# EAGLE schematic keyBoard_B (EAGLE 6.4)
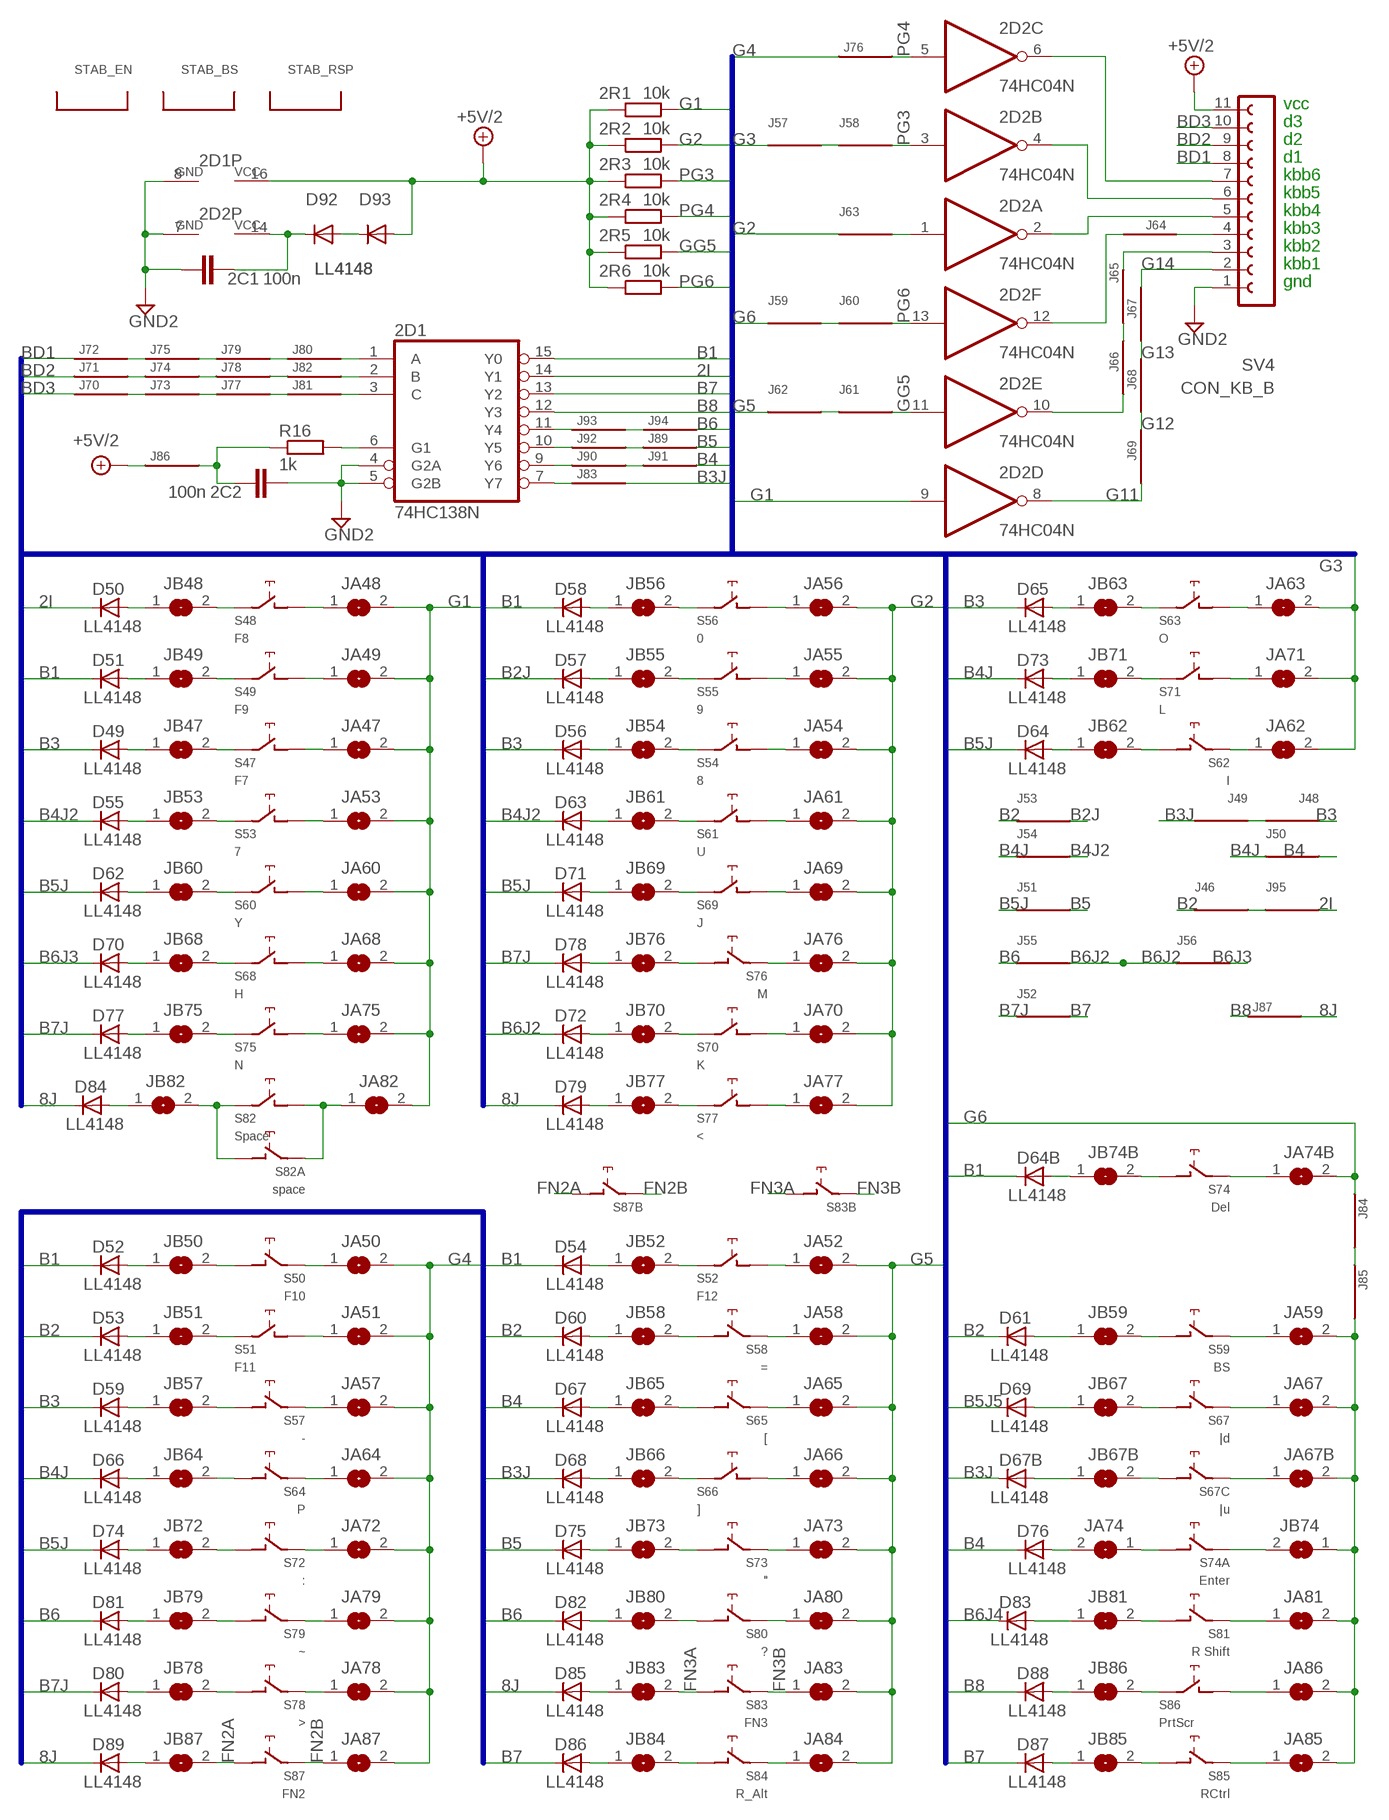
[diagram p0: schematic, sheet 1]

## Parts
2C1  100n  C-EUC1206  [C1206]
2C2  100n  C-EUC1206K  [C1206K]
2D1  74HC138N  74AC138N  [DIL16]
2D2  74HC04N  74ALS04N  [DIL14]
2R1  10k  R-EU_R0805  [R0805]
2R2  10k  R-EU_R0805  [R0805]
2R3  10k  R-EU_R0805  [R0805]
2R4  10k  R-EU_R1206W  [R1206W]
2R5  10k  R-EU_R0805  [R0805]
2R6  10k  R-EU_R0805  [R0805]
D49  LL4148  [SOD80C]
D50  LL4148  [SOD80C]
D51  LL4148  [SOD80C]
D52  LL4148  [SOD80C]
D53  LL4148  [SOD80C]
D54  LL4148  [SOD80C]
D55  LL4148  [SOD80C]
D56  LL4148  [SOD80C]
D57  LL4148  [SOD80C]
D58  LL4148  [SOD80C]
D59  LL4148  [SOD80C]
D60  LL4148  [SOD80C]
D61  LL4148  [SOD80C]
D62  LL4148  [SOD80C]
D63  LL4148  [SOD80C]
D64  LL4148  [SOD80C]
D64B  LL4148  [SOD80C]
D65  LL4148  [SOD80C]
D66  LL4148  [SOD80C]
D67  LL4148  [SOD80C]
D67B  LL4148  [SOD80C]
D68  LL4148  [SOD80C]
D69  LL4148  [SOD80C]
D70  LL4148  [SOD80C]
D71  LL4148  [SOD80C]
D72  LL4148  [SOD80C]
D73  LL4148  [SOD80C]
D74  LL4148  [SOD80C]
D75  LL4148  [SOD80C]
D76  LL4148  [SOD80C]
D77  LL4148  [SOD80C]
D78  LL4148  [SOD80C]
D79  LL4148  [SOD80C]
D80  LL4148  [SOD80C]
D81  LL4148  [SOD80C]
D82  LL4148  [SOD80C]
D83  LL4148  [SOD80C]
D84  LL4148  [SOD80C]
D85  LL4148  [SOD80C]
D86  LL4148  [SOD80C]
D87  LL4148  [SOD80C]
D88  LL4148  [SOD80C]
D89  LL4148  [SOD80C]
D92  LL4148  [SOD80C]
D93  LL4148  [SOD80C]
J46  J  [R1206W]
J48  J  [R1206W]
J49  J  [R1206W]
J50  J  [R1206W]
J51  J  [R1206W]
J52  J  [R1206W]
J53  J  [R1206W]
J54  J  [R1206W]
J55  J  [R1206W]
J56  J  [R1206W]
J57  J  [R1206W]
J58  J  [R1206W]
J59  J  [R1206W]
J60  J  [R1206W]
J61  J  [R1206W]
J62  J  [R1206W]
J63  J  [R1206W]
J64  J  [R1206W]
J65  J  [R1206W]
J66  J  [R1206W]
J67  J  [R1206W]
J68  J  [R1206W]
J69  J  [R1206W]
J70  J  [R1206W]
J71  J  [R1206W]
J72  J  [R1206W]
J73  J  [R1206W]
J74  J  [R1206W]
J75  J  [R1206W]
J76  J  [R1206W]
J77  J  [R1206W]
J78  J  [R1206W]
J79  J  [R1206W]
J80  J  [R1206W]
J81  J  [R1206W]
J82  J  [R1206W]
J83  J  [R1206W]
J84  J  [R1206W]
J85  J  [R1206W]
J86  J  [R1206W]
J87  J  [R1206W]
J89  J  [R1206W]
J90  J  [R1206W]
J91  J  [R1206W]
J92  J  [R1206W]
J93  J  [R1206W]
J94  J  [R1206W]
J95  J  [R1206W]
JA47  SJ  [SJ]
JA48  SJ  [SJ]
JA49  SJ  [SJ]
JA50  SJ  [SJ]
JA51  SJ  [SJ]
JA52  SJ  [SJ]
JA53  SJ  [SJ]
JA54  SJ  [SJ]
JA55  SJ  [SJ]
JA56  SJ  [SJ]
JA57  SJ  [SJ]
JA58  SJ  [SJ]
JA59  SJ  [SJ]
JA60  SJ  [SJ]
JA61  SJ  [SJ]
JA62  SJ  [SJ]
JA63  SJ  [SJ]
JA64  SJ  [SJ]
JA65  SJ  [SJ]
JA66  SJ  [SJ]
JA67  SJ  [SJ]
JA67B  SJ  [SJ]
JA68  SJ  [SJ]
JA69  SJ  [SJ]
JA70  SJ  [SJ]
JA71  SJ  [SJ]
JA72  SJ  [SJ]
JA73  SJ  [SJ]
JA74  SJ  [SJ]
JA74B  SJ  [SJ]
JA75  SJ  [SJ]
JA76  SJ  [SJ]
JA77  SJ  [SJ]
JA78  SJ  [SJ]
JA79  SJ  [SJ]
JA80  SJ  [SJ]
JA81  SJ  [SJ]
JA82  SJ  [SJ]
JA83  SJ  [SJ]
JA84  SJ  [SJ]
JA85  SJ  [SJ]
JA86  SJ  [SJ]
JA87  SJ  [SJ]
JB47  SJ  [SJ]
JB48  SJ  [SJ]
JB49  SJ  [SJ]
JB50  SJ  [SJ]
JB51  SJ  [SJ]
JB52  SJ  [SJ]
JB53  SJ  [SJ]
JB54  SJ  [SJ]
JB55  SJ  [SJ]
JB56  SJ  [SJ]
JB57  SJ  [SJ]
JB58  SJ  [SJ]
JB59  SJ  [SJ]
JB60  SJ  [SJ]
JB61  SJ  [SJ]
JB62  SJ  [SJ]
JB63  SJ  [SJ]
JB64  SJ  [SJ]
JB65  SJ  [SJ]
JB66  SJ  [SJ]
JB67  SJ  [SJ]
JB67B  SJ  [SJ]
JB68  SJ  [SJ]
JB69  SJ  [SJ]
JB70  SJ  [SJ]
JB71  SJ  [SJ]
JB72  SJ  [SJ]
JB73  SJ  [SJ]
JB74  SJ  [SJ]
JB74B  SJ  [SJ]
JB75  SJ  [SJ]
JB76  SJ  [SJ]
JB77  SJ  [SJ]
JB78  SJ  [SJ]
JB79  SJ  [SJ]
JB80  SJ  [SJ]
JB81  SJ  [SJ]
JB82  SJ  [SJ]
JB83  SJ  [SJ]
JB84  SJ  [SJ]
JB85  SJ  [SJ]
JB86  SJ  [SJ]
JB87  SJ  [SJ]
R16  1k  R-EU_R1206W  [R1206W]
S47  F7  CHERRY-MX-4P  [CHERRY-MX-4P]
S48  F8  CHERRY-MX-4P  [CHERRY-MX-4P]
S49  F9  CHERRY-MX-4P  [CHERRY-MX-4P]
S50  F10  CHERRY-MX-4P  [CHERRY-MX-4P]
S51  F11  CHERRY-MX-4P  [CHERRY-MX-4P]
S52  F12  CHERRY-MX-4P  [CHERRY-MX-4P]
S53  7  CHERRY-MX-4P  [CHERRY-MX-4P]
S54  8  CHERRY-MX-4P  [CHERRY-MX-4P]
S55  9  CHERRY-MX-4P  [CHERRY-MX-4P]
S56  0  CHERRY-MX-4P  [CHERRY-MX-4P]
S57  -  CHERRY-MX-4P  [CHERRY-MX-4P]
S58  =  CHERRY-MX-4P  [CHERRY-MX-4P]
S59  BS  CHERRY-MX-4P  [CHERRY-MX-4P]
S60  Y  CHERRY-MX-4P  [CHERRY-MX-4P]
S61  U  CHERRY-MX-4P  [CHERRY-MX-4P]
S62  I  CHERRY-MX-4P  [CHERRY-MX-4P]
S63  O  CHERRY-MX-4P  [CHERRY-MX-4P]
S64  P  CHERRY-MX-4P  [CHERRY-MX-4P]
S65  [  CHERRY-MX-4P  [CHERRY-MX-4P]
S66  ]  CHERRY-MX-4P  [CHERRY-MX-4P]
S67  |d  CHERRY-MX-4P  [CHERRY-MX-4P]
S67C  |u  CHERRY-MX-4P  [CHERRY-MX-4P]
S68  H  CHERRY-MX-4P  [CHERRY-MX-4P]
S69  J  CHERRY-MX-4P  [CHERRY-MX-4P]
S70  K  CHERRY-MX-4P  [CHERRY-MX-4P]
S71  L  CHERRY-MX-4P  [CHERRY-MX-4P]
S72  :  CHERRY-MX-4P  [CHERRY-MX-4P]
S73  "  CHERRY-MX-4P  [CHERRY-MX-4P]
S74  Del  CHERRY-MX-4P  [CHERRY-MX-4P]
S74A  Enter  CHERRY-MX-4P  [CHERRY-MX-4P]
S75  N  CHERRY-MX-4P  [CHERRY-MX-4P]
S76  M  CHERRY-MX-4P  [CHERRY-MX-4P]
S77  <  CHERRY-MX-4P  [CHERRY-MX-4P]
S78  >  CHERRY-MX-4P  [CHERRY-MX-4P]
S79  ~  CHERRY-MX-4P  [CHERRY-MX-4P]
S80  ?  CHERRY-MX-4P  [CHERRY-MX-4P]
S81  R Shift  CHERRY-MX-4P  [CHERRY-MX-4P]
S82  Space  CHERRY-MX-4P  [CHERRY-MX-4P]
S82A  space  CHERRY-MX  [CHERRY-MX]
S83  FN3  CHERRY-MX-4P  [CHERRY-MX-4P]
S83B  CHERRY-MX  [CHERRY-MX]
S84  R_Alt  CHERRY-MX-4P  [CHERRY-MX-4P]
S85  RCtrl  CHERRY-MX-4P  [CHERRY-MX-4P]
S86  PrtScr  CHERRY-MX-4P  [CHERRY-MX-4P]
S87  FN2  CHERRY-MX-4P  [CHERRY-MX-4P]
S87B  CHERRY-MX  [CHERRY-MX]
STAB_BS  STAB  [ZEALIOS-PCB_2U]
STAB_EN  STAB  [ZEALIOS-PCB_2U]
STAB_RSP  STAB  [ZEALIOS-PCB_2U]
SV4  CON_KB_B  FE12-1  [FE12]

## Nets
2I: 2D1.14(Y1) D50.C J95.1
8J: D79.C D84.C D85.C D89.C J87.1
+3VD: 2C1.1 2D2.14(P:VCC) D92.C
+5V/2: 2D1.16(VCC) 2R1.1 2R2.1 2R3.1 2R4.1 2R5.1 2R6.1 D93.A J86.2 SV4.11
B1: 2D1.15(Y0) D51.C D52.C D54.C D58.C D64B.C
B2: D53.C D60.C D61.C J46.2 J53.2
B2J: D57.C J53.1
B3: D49.C D56.C D59.C D65.C J48.2
B3J: D67B.C D68.C J49.1 J83.1
B4: D67.C D76.C J50.1 J91.1
B4J: D66.C D73.C J50.2 J54.2
B4J2: D55.C D63.C J54.1
B5: D75.C J51.1 J89.1
B5J: D62.C D64.C D71.C D74.C J51.2
B5J4: J89.2 J92.1
B5J5: 2D1.10(Y5) D69.C J92.2
B6: D81.C D82.C J55.2 J94.1
B6J2: D72.C J55.1 J56.2
B6J3: D70.C J56.1
B6J4: D83.C J93.1 J94.2
B7: 2D1.13(Y2) D86.C D87.C J52.1
B7J: D77.C D78.C D80.C J52.2
B8: 2D1.12(Y3) D88.C J87.2
BD1: J72.2 SV4.8
BD2: J71.2 SV4.9
BD3: J70.2 SV4.10
FN2A: JB87.2 S87.SW2(PIN-2) S87B.SW2(PIN-2)
FN2B: JA87.1 S87.SW1(PIN-1) S87B.SW1(PIN-1)
FN3A: JB83.2 S83.SW2(PIN-2) S83B.SW2(PIN-2)
FN3B: JA83.1 S83.SW1(PIN-1) S83B.SW1(PIN-1)
G1: 2D2.9(D:I) 2R1.2 JA47.2 JA48.2 JA49.2 JA53.2 JA60.2 JA68.2 JA75.2 JA82.2
G2: 2R2.2 J63.2 JA54.2 JA55.2 JA56.2 JA61.2 JA69.2 JA70.2 JA76.2 JA77.2
G3: J57.2 JA62.2 JA63.2 JA71.2
G4: J76.2 JA50.2 JA51.2 JA57.2 JA64.2 JA72.2 JA78.2 JA79.2 JA87.2
G5: J62.2 JA52.2 JA58.2 JA65.2 JA66.2 JA73.2 JA80.2 JA83.2 JA84.2
G6: J59.2 J84.2 JA74B.2
G6B: J84.1 J85.2
G6C: J85.1 JA59.2 JA67.2 JA67B.2 JA81.2 JA85.2 JA86.2 JB74.1
G11: 2D2.8(D:O) J69.2
G12: J68.2 J69.1
G13: J67.2 J68.1
G14: J67.1 SV4.2
GG5: 2D2.11(E:I) 2R5.2 J61.1
GND2: 2C1.2 2C2.2 2D1.4(G2A) 2D1.5(G2B) 2D1.8(GND) 2D2.7(P:GND) SV4.1
N$107: JB52.2 S52.SW1(PIN-1)
N$117: 2D1.7(Y7) J83.2
N$151: JB63.2 S63.SW1(PIN-1)
N$225: 2C2.1 J86.1 R16.1
N$229: JB74.2 S74A.SW1(PIN-1)
N$230: JA74.1 S74A.SW2(PIN-2)
N$233: JB47.2 S47.SW1(PIN-1)
N$234: JB53.2 S53.SW1(PIN-1)
N$235: JB60.2 S60.SW1(PIN-1)
N$236: JB68.2 S68.SW1(PIN-1)
N$237: JB75.2 S75.SW1(PIN-1)
N$238: JB82.2 S82.SW1(PIN-1) S82A.SW2(PIN-2)
N$239: JB48.2 S48.SW1(PIN-1)
N$240: JB54.2 S54.SW1(PIN-1)
N$241: JB61.2 S61.SW1(PIN-1)
N$242: JB69.2 S69.SW1(PIN-1)
N$243: JB49.2 S49.SW1(PIN-1)
N$244: JB55.2 S55.SW1(PIN-1)
N$245: JB70.2 S70.SW1(PIN-1)
N$246: JB77.2 S77.SW1(PIN-1)
N$247: JB56.2 S56.SW1(PIN-1)
N$248: JB51.2 S51.SW1(PIN-1)
N$249: D49.A JB47.1
N$250: D55.A JB53.1
N$251: D62.A JB60.1
N$252: D70.A JB68.1
N$253: D77.A JB75.1
N$254: D84.A JB82.1
N$255: D50.A JB48.1
N$256: D56.A JB54.1
N$257: D63.A JB61.1
N$258: D71.A JB69.1
N$259: D78.A JB76.1
N$260: D85.A JB83.1
N$261: D51.A JB49.1
N$262: D57.A JB55.1
N$263: D64.A JB62.1
N$264: D72.A JB70.1
N$265: D79.A JB77.1
N$266: D86.A JB84.1
N$267: D52.A JB50.1
N$268: D58.A JB56.1
N$269: D65.A JB63.1
N$270: D73.A JB71.1
N$271: D80.A JB78.1
N$272: D87.A JB85.1
N$274: D53.A JB51.1
N$275: D59.A JB57.1
N$277: D66.A JB64.1
N$278: D74.A JB72.1
N$279: D81.A JB79.1
N$280: D88.A JB86.1
N$281: D54.A JB52.1
N$282: D60.A JB58.1
N$283: D67.A JB65.1
N$285: D75.A JB73.1
N$286: D82.A JB80.1
N$287: D61.A JB59.1
N$288: D68.A JB66.1
N$289: D69.A JB67.1
N$290: D83.A JB81.1
N$291: JA47.1 S47.SW2(PIN-2)
N$292: JA53.1 S53.SW2(PIN-2)
N$293: JA60.1 S60.SW2(PIN-2)
N$294: JA68.1 S68.SW2(PIN-2)
N$295: JA75.1 S75.SW2(PIN-2)
N$296: JA82.1 S82.SW2(PIN-2) S82A.SW1(PIN-1)
N$297: JA48.1 S48.SW2(PIN-2)
N$298: JA54.1 S54.SW2(PIN-2)
N$299: JA61.1 S61.SW2(PIN-2)
N$300: JA69.1 S69.SW2(PIN-2)
N$301: JA49.1 S49.SW2(PIN-2)
N$302: JA55.1 S55.SW2(PIN-2)
N$303: JA70.1 S70.SW2(PIN-2)
N$304: JA77.1 S77.SW2(PIN-2)
N$305: JA56.1 S56.SW2(PIN-2)
N$306: JA63.1 S63.SW2(PIN-2)
N$307: JA51.1 S51.SW2(PIN-2)
N$308: JA52.1 S52.SW2(PIN-2)
N$309: D64B.A JB74B.1
N$310: 2D1.11(Y4) J93.2
N$311: JA67B.1 S67C.SW1(PIN-1)
N$312: D76.A JA74.2
N$313: JB67.2 S67.SW2(PIN-2)
N$314: JA67.1 S67.SW1(PIN-1)
N$315: JB81.2 S81.SW2(PIN-2)
N$316: JA81.1 S81.SW1(PIN-1)
N$317: JB59.2 S59.SW2(PIN-2)
N$318: JA59.1 S59.SW1(PIN-1)
N$319: JB85.2 S85.SW2(PIN-2)
N$320: JA85.1 S85.SW1(PIN-1)
N$321: JB74B.2 S74.SW2(PIN-2)
N$322: JA74B.1 S74.SW1(PIN-1)
N$323: 2D1.9(Y6) J90.2
N$326: D89.A JB87.1
N$327: JB50.2 S50.SW2(PIN-2)
N$328: JA50.1 S50.SW1(PIN-1)
N$329: JB78.2 S78.SW2(PIN-2)
N$330: JA78.1 S78.SW1(PIN-1)
N$331: D67B.A JB67B.1
N$332: JB58.2 S58.SW2(PIN-2)
N$333: JB65.2 S65.SW2(PIN-2)
N$334: JA65.1 S65.SW1(PIN-1)
N$335: JA58.1 S58.SW1(PIN-1)
N$336: JB66.2 S66.SW1(PIN-1)
N$337: JA66.1 S66.SW2(PIN-2)
N$338: JB79.2 S79.SW2(PIN-2)
N$339: JA79.1 S79.SW1(PIN-1)
N$342: JB73.2 S73.SW2(PIN-2)
N$343: JA73.1 S73.SW1(PIN-1)
N$344: JA80.1 S80.SW1(PIN-1)
N$345: JB80.2 S80.SW2(PIN-2)
N$346: JB84.2 S84.SW2(PIN-2)
N$347: JA84.1 S84.SW1(PIN-1)
N$349: JB57.2 S57.SW2(PIN-2)
N$350: JA57.1 S57.SW1(PIN-1)
N$351: JA64.1 S64.SW1(PIN-1)
N$352: JB64.2 S64.SW2(PIN-2)
N$353: JB72.2 S72.SW2(PIN-2)
N$354: JA72.1 S72.SW1(PIN-1)
N$355: J48.1 J49.2
N$356: JB62.2 S62.SW2(PIN-2)
N$357: JA62.1 S62.SW1(PIN-1)
N$358: JB71.2 S71.SW1(PIN-1)
N$359: JA71.1 S71.SW2(PIN-2)
N$360: 2D1.6(G1) R16.2
N$361: JB76.2 S76.SW2(PIN-2)
N$362: JA76.1 S76.SW1(PIN-1)
N$363: 2D2.6(C:O) SV4.7
N$364: 2D2.4(B:O) SV4.6
N$365: 2D2.2(A:O) SV4.5
N$366: 2D2.12(F:O) J64.2
N$368: J57.1 J58.2
N$369: J59.1 J60.2
N$370: 2D2.1(A:I) J63.1
N$371: J64.1 SV4.4
N$372: J65.1 SV4.3
N$373: J65.2 J66.1
N$374: 2D2.10(E:O) J66.2
N$378: D92.A D93.C
N$379: J70.1 J73.2
N$380: J71.1 J74.2
N$381: J72.1 J75.2
N$382: J73.1 J77.2
N$383: J74.1 J78.2
N$384: J75.1 J79.2
N$385: J79.1 J80.2
N$386: J77.1 J81.2
N$387: J78.1 J82.2
N$388: 2D1.1(A) J80.1
N$389: 2D1.2(B) J82.1
N$391: 2D1.3(C) J81.1
N$396: JB86.2 S86.SW1(PIN-1)
N$397: JA86.1 S86.SW2(PIN-2)
N$399: J90.1 J91.2
N$405: J46.1 J95.2
N$406: JB67B.2 S67C.SW2(PIN-2)
PG3: 2D2.3(B:I) 2R3.2 J58.1
PG4: 2D2.5(C:I) 2R4.2 J76.1
PG5: J61.2 J62.1
PG6: 2D2.13(F:I) 2R6.2 J60.1
Unconnected: S47.D1(_D:D1) S47.D2(_D:D2) S47.LED1(_L:LED1) S47.LED2(_L:LED2) S48.D1(_D:D1) S48.D2(_D:D2) S48.LED1(_L:LED1) S48.LED2(_L:LED2) S49.D1(_D:D1) S49.D2(_D:D2) S49.LED1(_L:LED1) S49.LED2(_L:LED2) S50.D1(_D:D1) S50.D2(_D:D2) S50.LED1(_L:LED1) S50.LED2(_L:LED2) S51.D1(_D:D1) S51.D2(_D:D2) S51.LED1(_L:LED1) S51.LED2(_L:LED2) S52.D1(_D:D1) S52.D2(_D:D2) S52.LED1(_L:LED1) S52.LED2(_L:LED2) S53.D1(_D:D1) S53.D2(_D:D2) S53.LED1(_L:LED1) S53.LED2(_L:LED2) S54.D1(_D:D1) S54.D2(_D:D2) S54.LED1(_L:LED1) S54.LED2(_L:LED2) S55.D1(_D:D1) S55.D2(_D:D2) S55.LED1(_L:LED1) S55.LED2(_L:LED2) S56.D1(_D:D1) S56.D2(_D:D2) S56.LED1(_L:LED1) S56.LED2(_L:LED2) S57.D1(_D:D1) S57.D2(_D:D2) S57.LED1(_L:LED1) S57.LED2(_L:LED2) S58.D1(_D:D1) S58.D2(_D:D2) S58.LED1(_L:LED1) S58.LED2(_L:LED2) S59.D1(_D:D1) S59.D2(_D:D2) S59.LED1(_L:LED1) S59.LED2(_L:LED2) S60.D1(_D:D1) S60.D2(_D:D2) S60.LED1(_L:LED1) S60.LED2(_L:LED2) S61.D1(_D:D1) S61.D2(_D:D2) S61.LED1(_L:LED1) S61.LED2(_L:LED2) S62.D1(_D:D1) S62.D2(_D:D2) S62.LED1(_L:LED1) S62.LED2(_L:LED2) S63.D1(_D:D1) S63.D2(_D:D2) S63.LED1(_L:LED1) S63.LED2(_L:LED2) S64.D1(_D:D1) S64.D2(_D:D2) S64.LED1(_L:LED1) S64.LED2(_L:LED2) S65.D1(_D:D1) S65.D2(_D:D2) S65.LED1(_L:LED1) S65.LED2(_L:LED2) S66.D1(_D:D1) S66.D2(_D:D2) S66.LED1(_L:LED1) S66.LED2(_L:LED2) S67.D1(_D:D1) S67.D2(_D:D2) S67.LED1(_L:LED1) S67.LED2(_L:LED2) S67C.D1(_D:D1) S67C.D2(_D:D2) S67C.LED1(_L:LED1) S67C.LED2(_L:LED2) S68.D1(_D:D1) S68.D2(_D:D2) S68.LED1(_L:LED1) S68.LED2(_L:LED2) S69.D1(_D:D1) S69.D2(_D:D2) S69.LED1(_L:LED1) S69.LED2(_L:LED2) S70.D1(_D:D1) S70.D2(_D:D2) S70.LED1(_L:LED1) S70.LED2(_L:LED2) S71.D1(_D:D1) S71.D2(_D:D2) S71.LED1(_L:LED1) S71.LED2(_L:LED2) S72.D1(_D:D1) S72.D2(_D:D2) S72.LED1(_L:LED1) S72.LED2(_L:LED2) S73.D1(_D:D1) S73.D2(_D:D2) S73.LED1(_L:LED1) S73.LED2(_L:LED2) S74.D1(_D:D1) S74.D2(_D:D2) S74.LED1(_L:LED1) S74.LED2(_L:LED2) S74A.D1(_D:D1) S74A.D2(_D:D2) S74A.LED1(_L:LED1) S74A.LED2(_L:LED2) S75.D1(_D:D1) S75.D2(_D:D2) S75.LED1(_L:LED1) S75.LED2(_L:LED2) S76.D1(_D:D1) S76.D2(_D:D2) S76.LED1(_L:LED1) S76.LED2(_L:LED2) S77.D1(_D:D1) S77.D2(_D:D2) S77.LED1(_L:LED1) S77.LED2(_L:LED2) S78.D1(_D:D1) S78.D2(_D:D2) S78.LED1(_L:LED1) S78.LED2(_L:LED2) S79.D1(_D:D1) S79.D2(_D:D2) S79.LED1(_L:LED1) S79.LED2(_L:LED2) S80.D1(_D:D1) S80.D2(_D:D2) S80.LED1(_L:LED1) S80.LED2(_L:LED2) S81.D1(_D:D1) S81.D2(_D:D2) S81.LED1(_L:LED1) S81.LED2(_L:LED2) S82.D1(_D:D1) S82.D2(_D:D2) S82.LED1(_L:LED1) S82.LED2(_L:LED2) S83.D1(_D:D1) S83.D2(_D:D2) S83.LED1(_L:LED1) S83.LED2(_L:LED2) S84.D1(_D:D1) S84.D2(_D:D2) S84.LED1(_L:LED1) S84.LED2(_L:LED2) S85.D1(_D:D1) S85.D2(_D:D2) S85.LED1(_L:LED1) S85.LED2(_L:LED2) S86.D1(_D:D1) S86.D2(_D:D2) S86.LED1(_L:LED1) S86.LED2(_L:LED2) S87.D1(_D:D1) S87.D2(_D:D2) S87.LED1(_L:LED1) S87.LED2(_L:LED2)

## Buses
B[1..8],B3J,B4J,B5J,B6J,B7J,8J,B4J2,B5J2,B5J5,B6J2,B6J3,B6J4,B8J2,2I,B2J,G[1..6],GG5,PG[3..6],BD[1..3]

## Notes on the sheet
- vcc
- d3
- d2
- d1
- kbb6
- kbb5
- kbb4
- kbb3
- kbb2
- kbb1
- gnd

## Library data of the parts
2C1 2C2 = rcl:C-EU: CAPACITOR, European symbol
2D1 = detali2:74*138: 3-line to 8-line DECODER/DEMULTIPLEXER
2D2 = detali2:74*04: Hex INVERTER
2R1-2R6 R16 = rcl:R-EU_: RESISTOR, European symbol
D49-D64 D64B D65-D67 D67B D68-D89 D92 D93 = detali:LL4148: DIODE high speed
J46 J48-J87 J89-J95 = detali2:J
JA47-JA67 JA67B JA68-JA74 JA74B JA75-JA87 JB47-JB67 JB67B JB68-JB74 JB74B JB75-JB87 = detali:SJ: SMD solder JUMPER
S47-S67 S67C S68-S74 S74A S75-S87 = cherrymx:CHERRY-MX-4P
S82A S83B S87B = cherrymx:CHERRY-MX: Cherry MX series keyswitch
STAB_BS STAB_EN STAB_RSP = kbmxco:STAB
SV4 = detali2:FE12-1: FEMALE HEADER; OC_FARNELL: unknown; OC_NEWARK: unknown

## Net classes
1 power: width 0.254 mm, drill 0.61 mm, clearance 0.254 mm
2 gnd: width 0.254 mm, drill 0.61 mm, clearance 0.254 mm
3 usbvcc: width 0.254 mm, drill 0.61 mm, clearance 0.254 mm
4 aref: width 0.254 mm, drill 0.61 mm, clearance 0.254 mm